# EAGLE schematic Main&MotorBoard (EAGLE 9.7.0)
Assembly variants: supply, A

## Sheet 1 of 7: Cover
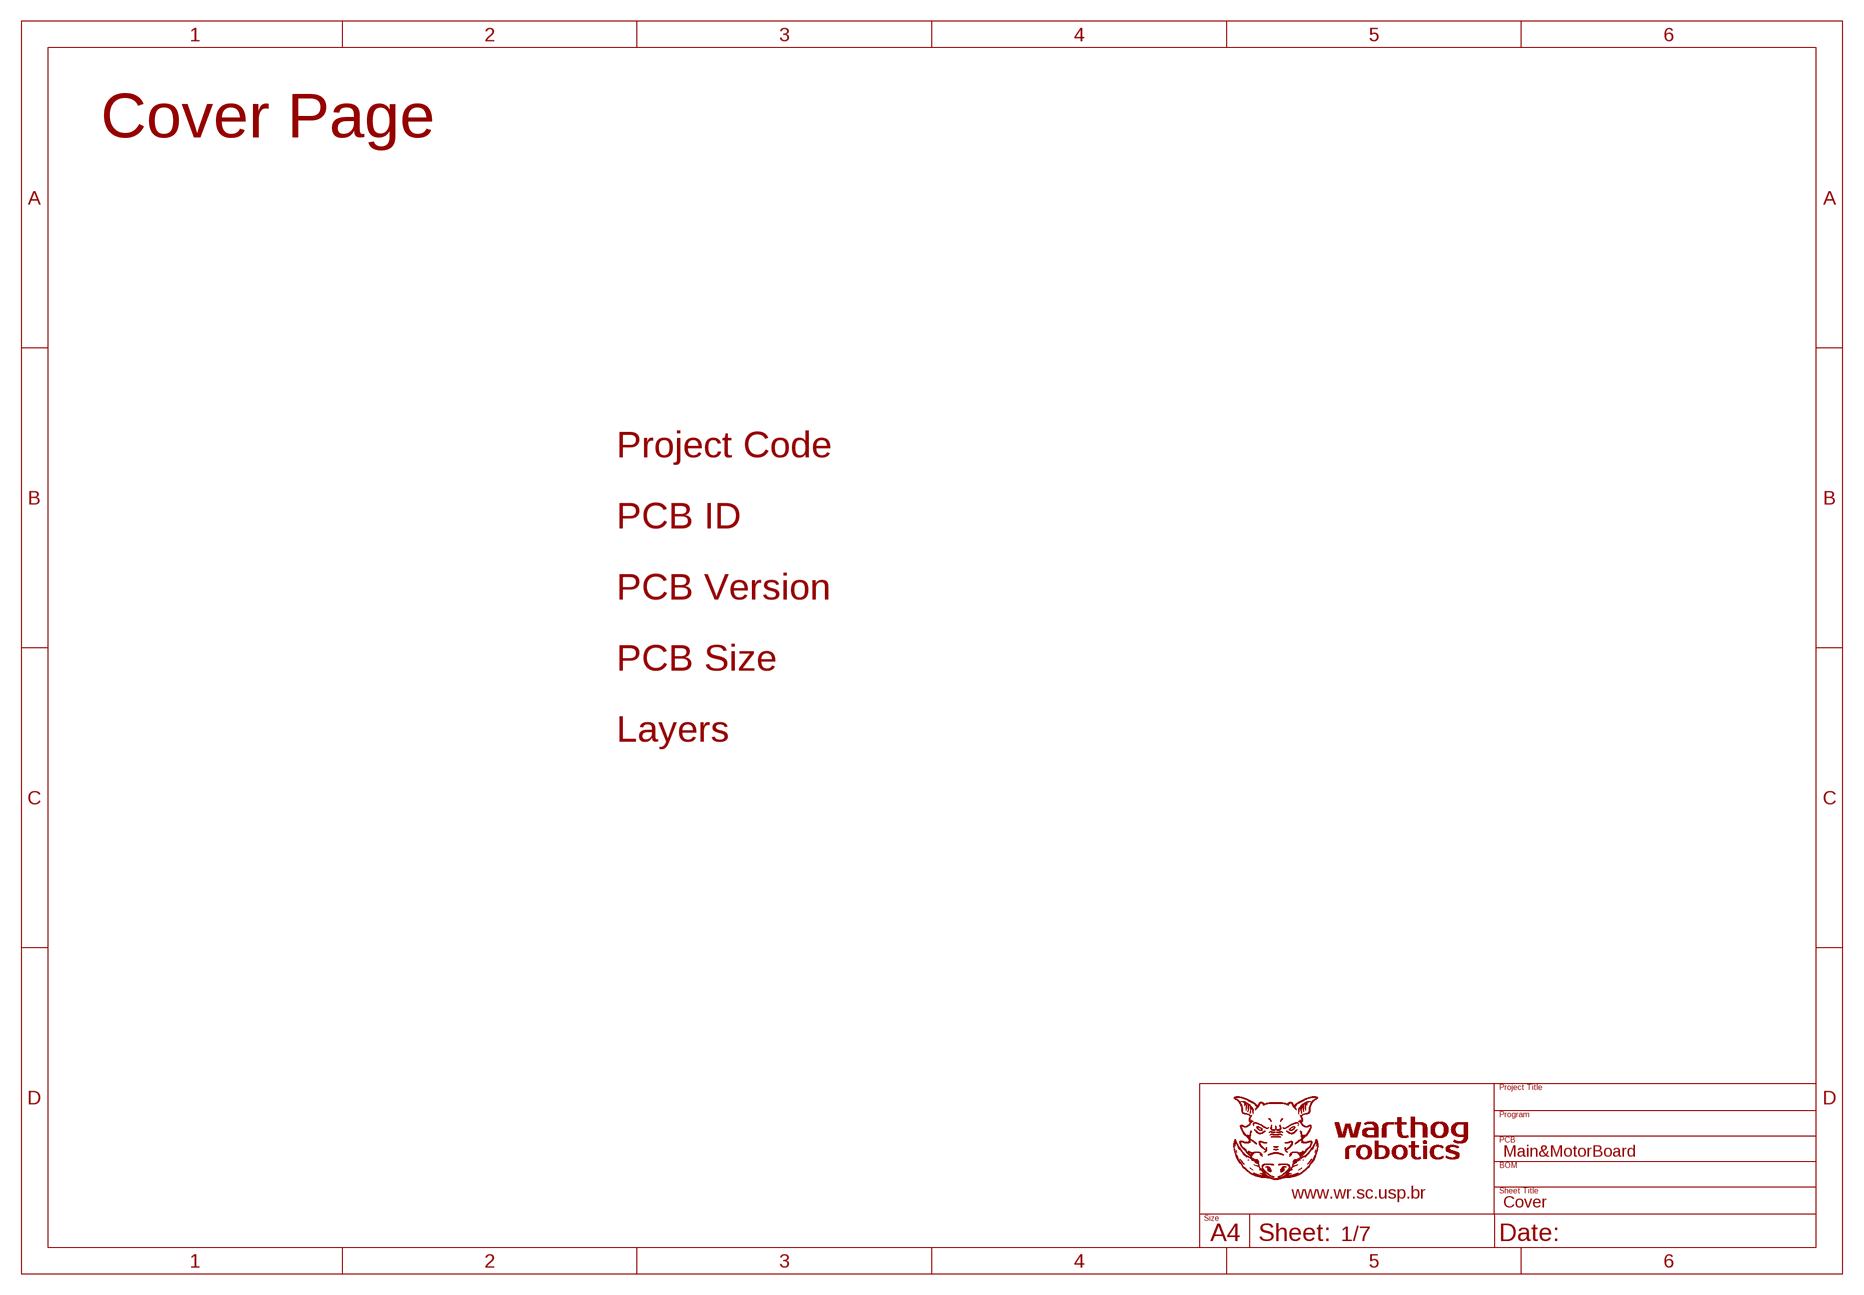
[diagram p0: schematic, sheet 1]

## Sheet 2 of 7: SUPPLY
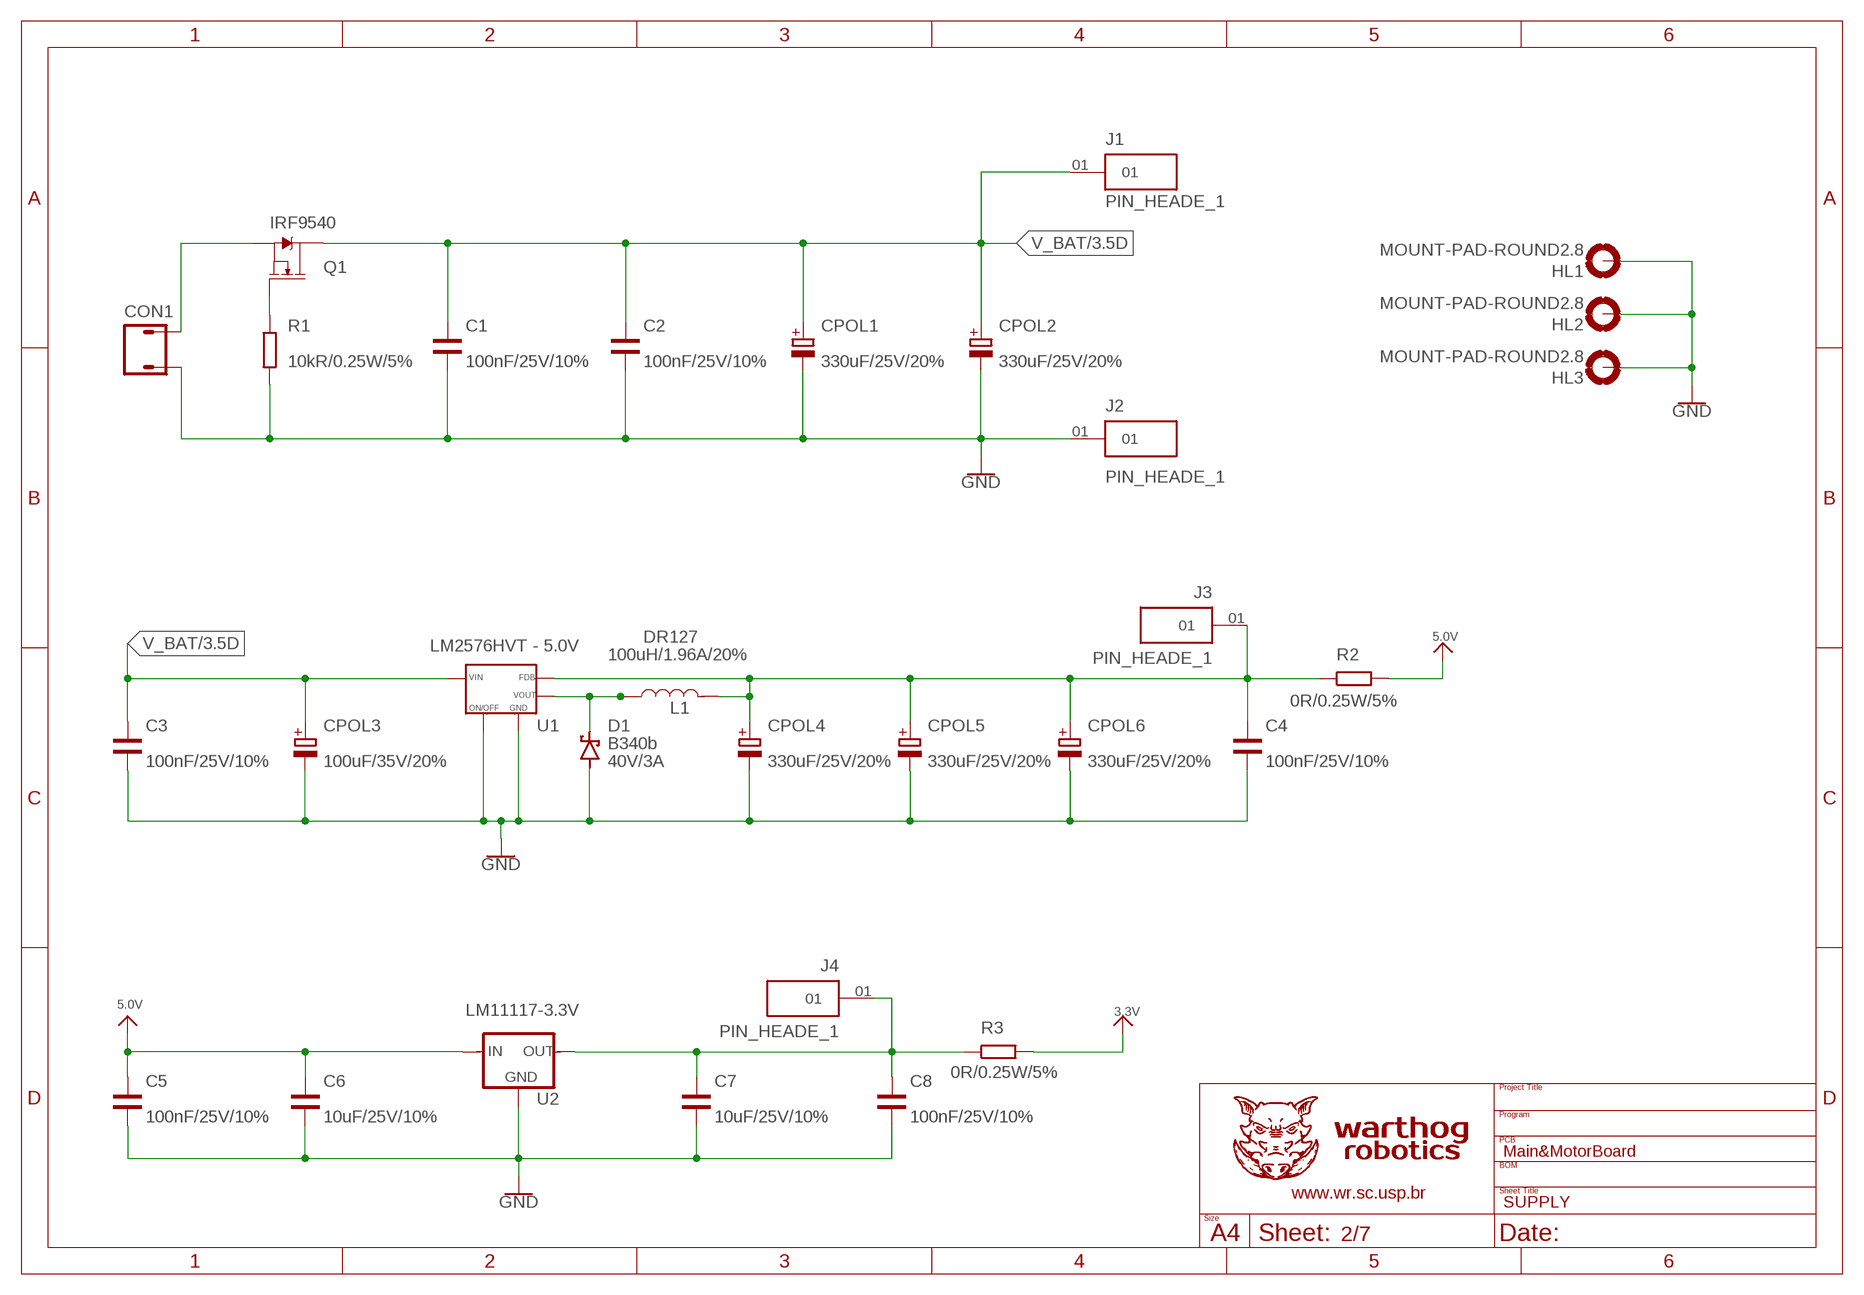
[diagram p1: schematic, sheet 2]

### Parts
C1  100nF/25V/10%  C0805(M)  [C0805(M)]
C2  100nF/25V/10%  C0805(M)  [C0805(M)]
C3  100nF/25V/10%  C0805(M)  [C0805(M)]
C4  100nF/25V/10%  C0805(M)  [C0805(M)]
C5  100nF/25V/10%  C0805(M)  [C0805(M)]
C6  10uF/25V/10%  C0805(M)  [C0805(M)]
C7  10uF/25V/10%  C0805(M)  [C0805(M)]
C8  100nF/25V/10%  C0805(M)  [C0805(M)]
CON1  MICROFIT_HEADER-2X01-90°-BACKUP  [2X01-3.00MM-90°]
CPOL1  330uF/25V/20%  CPOLE5-10.5  [E5-10,5]
CPOL2  330uF/25V/20%  CPOLE5-10.5  [E5-10,5]
CPOL3  100uF/35V/20%  CPOLE5-10.5  [E5-10,5]
CPOL4  330uF/25V/20%  CPOLE5-10.5  [E5-10,5]
CPOL5  330uF/25V/20%  CPOLE5-10.5  [E5-10,5]
CPOL6  330uF/25V/20%  CPOLE5-10.5  [E5-10,5]
D1  40V/3A  DIODE_SCHOTTIK  [SMC]
HL1  MOUNT-PAD-ROUND2.8  [2,8-PAD]
HL2  MOUNT-PAD-ROUND2.8  [2,8-PAD]
HL3  MOUNT-PAD-ROUND2.8  [2,8-PAD]
J1  PIN_HEADE_1  [SAMTEC_MTMM-101-X-X-S-X]
J2  PIN_HEADE_1  [SAMTEC_MTMM-101-X-X-S-X]
J3  PIN_HEADE_1  [SAMTEC_MTMM-101-X-X-S-X]
J4  PIN_HEADE_1  [SAMTEC_MTMM-101-X-X-S-X]
L1  100uH/1.96A/20%  INDUCTOR  [DR127]
Q1  IRF9540  [TO254P1052X465X1989-3]
R1  10kR/0.25W/5%  R0805(M)  [C0805(M)]  (not fitted in variant supply)
R2  0R/0.25W/5%  R0805(M)  [C0805(M)]
R3  0R/0.25W/5%  R0805(M)  [C0805(M)]
U1  LM2576HVT - 5.0V  LM2576  [TO263-5]
U2  LM11117-3.3V  REG1117  [SOT230P700X170-4]

### Nets
3.3V [Power]: R3.2 ; also sheet 4,5,6,7
5.0V [Power]: C5.1 C6.1 R2.2 U2.3(IN) ; also sheet 3,4
FDB: C4.1 CPOL4.+ CPOL5.+ CPOL6.+ J3.01 L1.1 R2.1 U1.FDB(FEEDBACK)
GND [Power]: C1.2 C2.2 C3.2 C4.2 C5.2 C6.2 C7.2 C8.2 CON1.2 CPOL1.- CPOL2.- CPOL3.- CPOL4.- CPOL5.- CPOL6.- D1.A HL1.B2,8(MOUNT) HL2.B2,8(MOUNT) HL3.B2,8(MOUNT) J2.01 R1.2 U1.GND U1.ON/OFF(ON\OFF) U1.TAB(GND) U2.1(GND) ; also sheet 3,4,5,6,7
N$5: CON1.1 Q1.S
N$7: Q1.G R1.1
N$11 [Power]: D1.C L1.2 U1.OUT
OUT_3.3: C7.1 C8.1 J4.01 R3.1 U2.2(OUT) U2.4(OUT)
V_BAT: C1.1 C2.1 C3.1 CPOL1.+ CPOL2.+ CPOL3.+ J1.01 Q1.D U1.VIN ; also sheet 3,4

### Notes on the sheet
- DR127
- B340b

## Sheet 3 of 7: MOTOR DRIVE
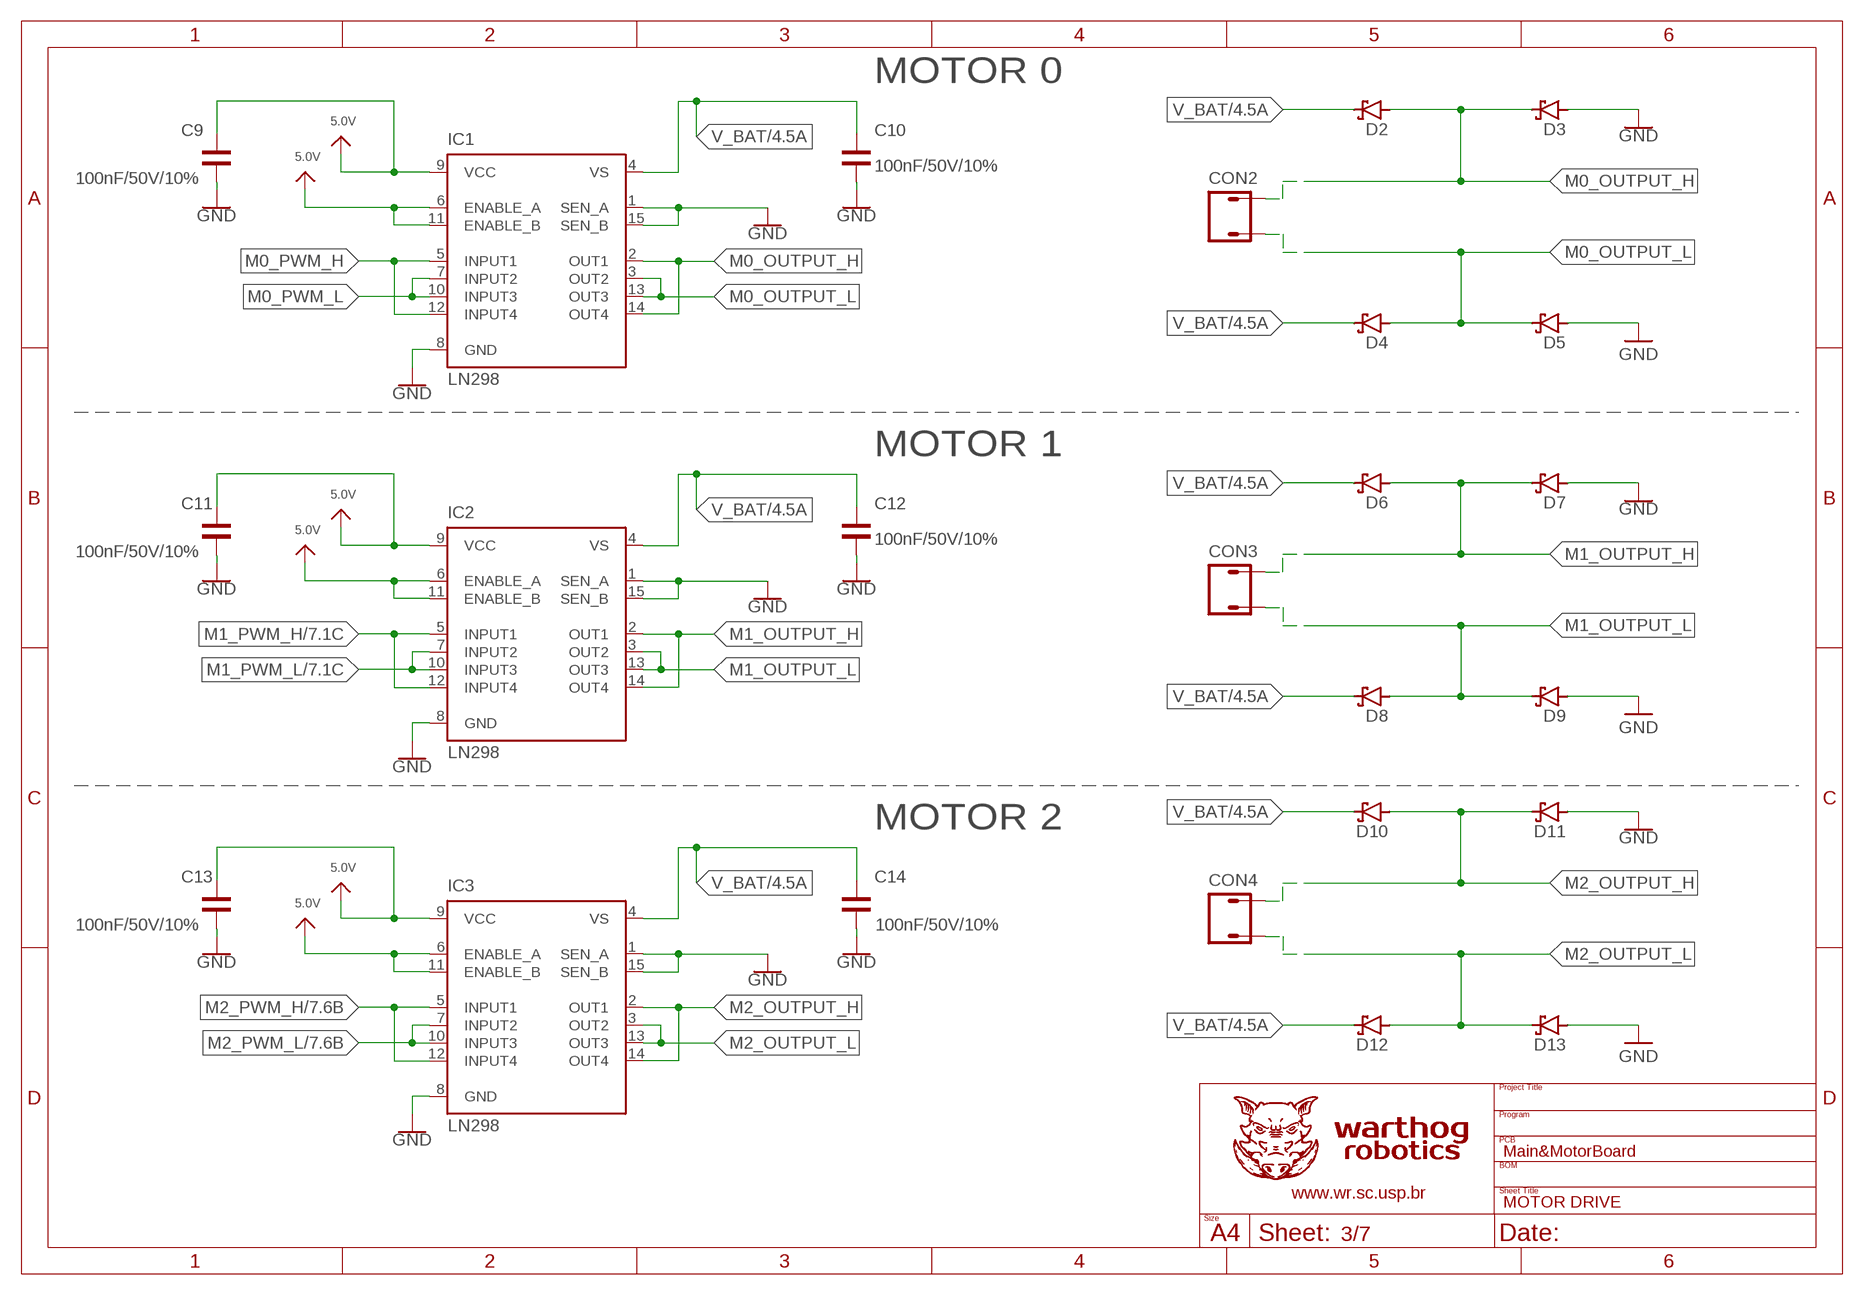
[diagram p2: schematic, sheet 3]

### Parts
C9  100nF/50V/10%  C0805(N)  [C0805(N)]
C10  100nF/50V/10%  C0805(N)  [C0805(N)]
C11  100nF/50V/10%  C0805(N)  [C0805(N)]
C12  100nF/50V/10%  C0805(N)  [C0805(N)]
C13  100nF/50V/10%  C0805(N)  [C0805(N)]
C14  100nF/50V/10%  C0805(N)  [C0805(N)]
CON2  MICROFIT_HEADER-2X01-90°-BACKUP  [2X01-3.00MM-90°]
CON3  MICROFIT_HEADER-2X01-90°-BACKUP  [2X01-3.00MM-90°]
CON4  MICROFIT_HEADER-2X01-90°-BACKUP  [2X01-3.00MM-90°]
D2  1N5406  [DO201-15(N)]
D3  1N5406  [DO201-15(N)]
D4  1N5406  [DO201-15(N)]
D5  1N5406  [DO201-15(N)]
D6  1N5406  [DO201-15(N)]
D7  1N5406  [DO201-15(N)]
D8  1N5406  [DO201-15(N)]
D9  1N5406  [DO201-15(N)]
D10  1N5406  [DO201-15(N)]
D11  1N5406  [DO201-15(N)]
D12  1N5406  [DO201-15(N)]
D13  1N5406  [DO201-15(N)]
IC1  LN298  L298  [MULTIWATT-15]  (not fitted in variant supply)
IC2  LN298  L298  [MULTIWATT-15]  (not fitted in variant supply)
IC3  LN298  L298  [MULTIWATT-15]  (not fitted in variant supply)

### Nets
5.0V [Power]: C9.1 C11.1 C13.1 IC1.6(ENABLE_A) IC1.9(VCC) IC1.11(ENABLE_B) IC2.6(ENABLE_A) IC2.9(VCC) IC2.11(ENABLE_B) IC3.6(ENABLE_A) IC3.9(VCC) IC3.11(ENABLE_B) ; also sheet 2,4
GND [Power]: C9.2 C10.2 C11.2 C12.2 C13.2 C14.2 D3.A D5.A D7.A D9.A D11.A D13.A IC1.1(SEN_A) IC1.8(GND) IC1.15(SEN_B) IC2.1(SEN_A) IC2.8(GND) IC2.15(SEN_B) IC3.1(SEN_A) IC3.8(GND) IC3.15(SEN_B) ; also sheet 2,4,5,6,7
M0_OUTPUT_H: CON2.1 D2.A D3.C IC1.2(OUT1) IC1.14(OUT4)
M0_OUTPUT_L: CON2.2 D4.A D5.C IC1.3(OUT2) IC1.13(OUT3)
M0_PWM_H: IC1.5(INPUT1) IC1.12(INPUT4)
M0_PWM_L: IC1.7(INPUT2) IC1.10(INPUT3)
M1_OUTPUT_H: CON3.1 D6.A D7.C IC2.2(OUT1) IC2.14(OUT4)
M1_OUTPUT_L: CON3.2 D8.A D9.C IC2.3(OUT2) IC2.13(OUT3)
M1_PWM_H: IC2.5(INPUT1) IC2.12(INPUT4) ; also sheet 7
M1_PWM_L: IC2.7(INPUT2) IC2.10(INPUT3) ; also sheet 7
M2_OUTPUT_H: CON4.1 D10.A D11.C IC3.2(OUT1) IC3.14(OUT4)
M2_OUTPUT_L: CON4.2 D12.A D13.C IC3.3(OUT2) IC3.13(OUT3)
M2_PWM_H: IC3.5(INPUT1) IC3.12(INPUT4) ; also sheet 7
M2_PWM_L: IC3.7(INPUT2) IC3.10(INPUT3) ; also sheet 7
V_BAT: C10.1 C12.1 C14.1 D2.C D4.C D6.C D8.C D10.C D12.C IC1.4(VS) IC2.4(VS) IC3.4(VS) ; also sheet 2,4

### Notes on the sheet
- MOTOR 0
- MOTOR 1
- MOTOR 2

## Sheet 4 of 7: COMMUNICATION
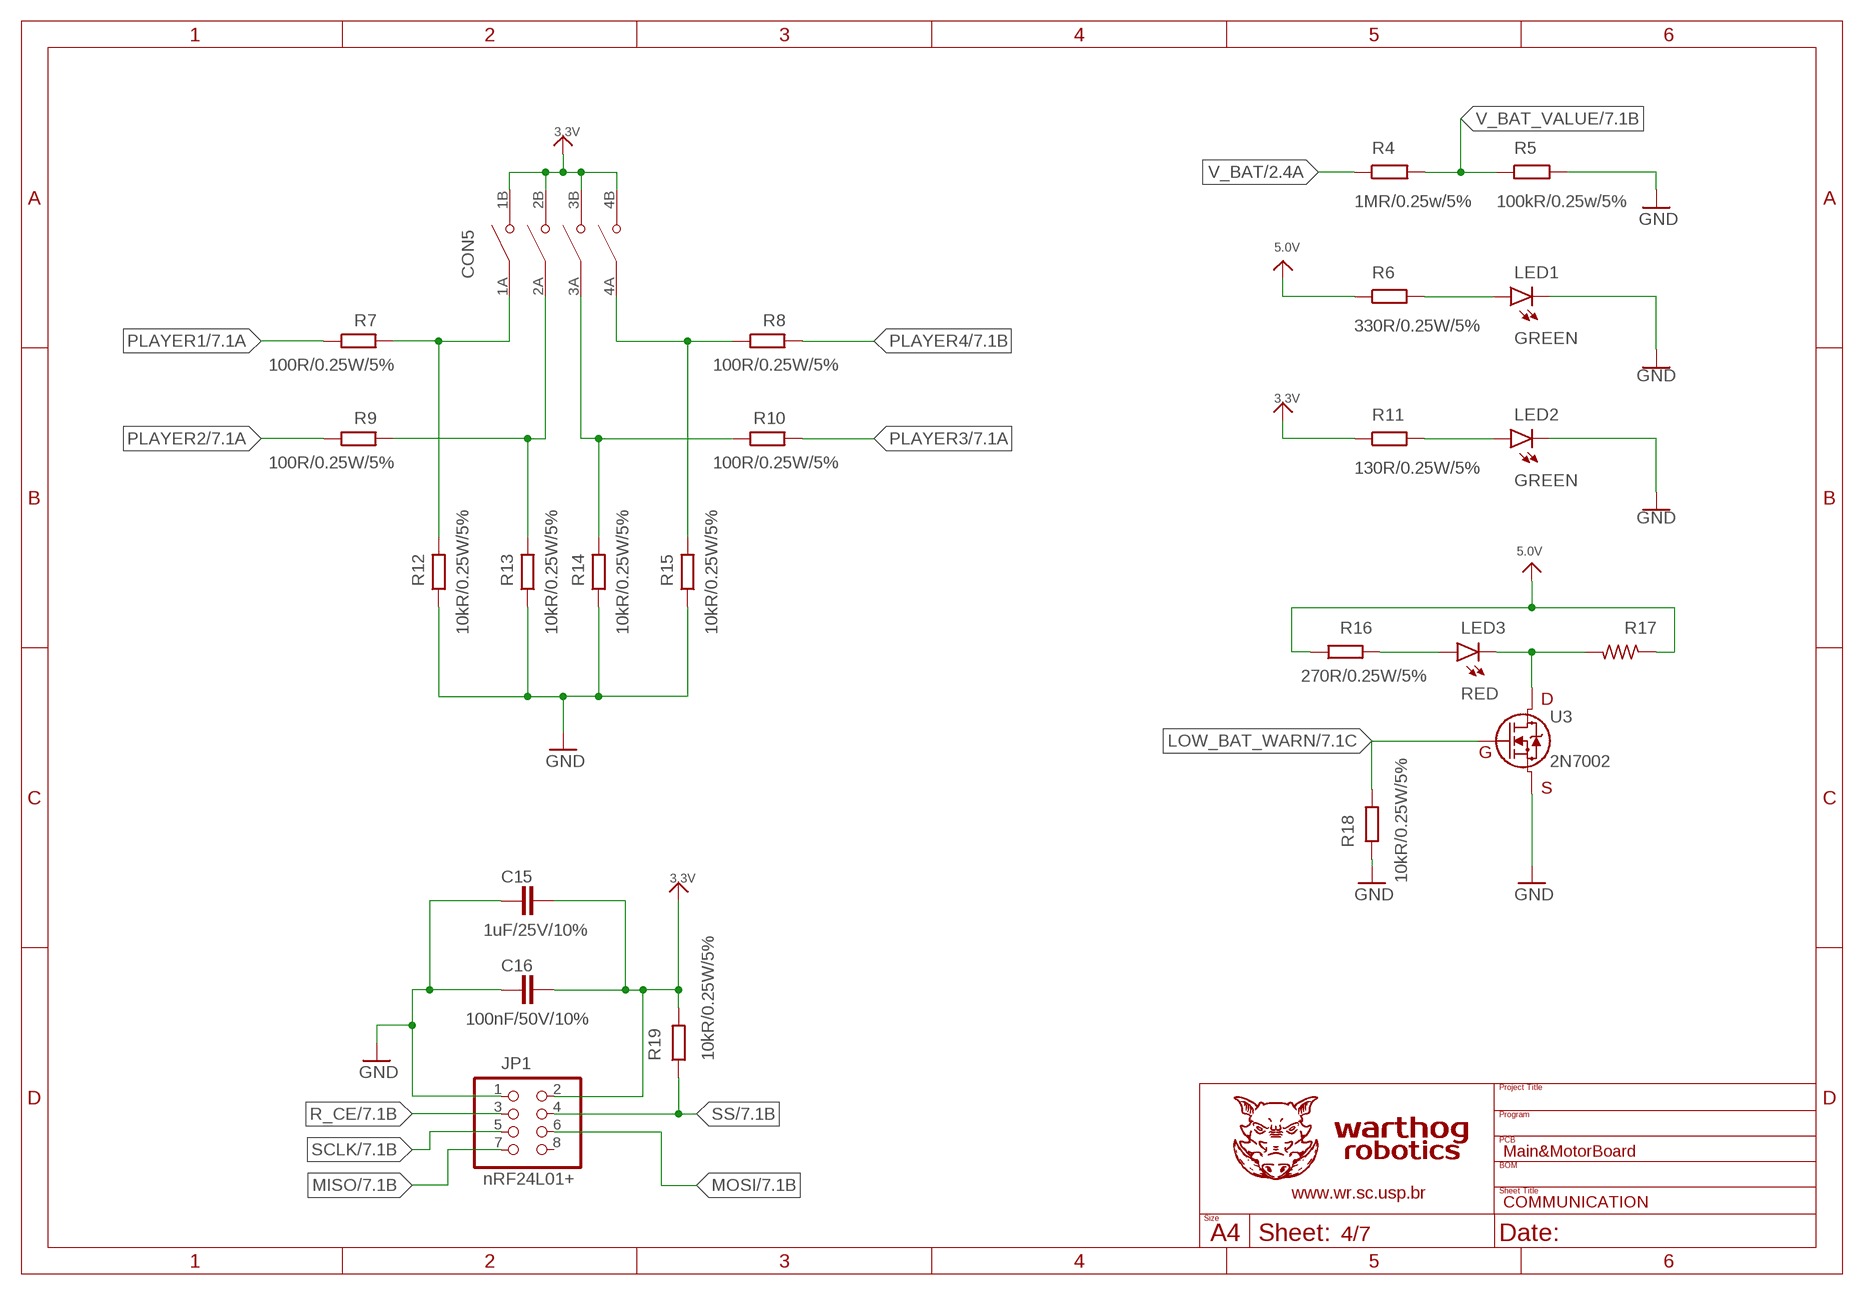
[diagram p3: schematic, sheet 4]

### Parts
C15  1uF/25V/10%  C-EUC0805  [C0805]
C16  100nF/50V/10%  C-EUC0805  [C0805]
CON5  DS01C-254-L-04BE  [SW_DS01C-254-L-04BE]
JP1  nRF24L01+  PINHD-2X4  [2X04]
LED1  GREEN  LEDSML0402  [SML0402]
LED2  GREEN  LEDSML0402  [SML0402]
LED3  RED  LEDSML0402  [SML0402]
R4  1MR/0.25w/5%  R-EU_R0805  [R0805]
R5  100kR/0.25w/5%  R-EU_R0805  [R0805]
R6  330R/0.25W/5%  RC0603(M)  [C0603(M)]
R7  100R/0.25W/5%  R0805(M)  [C0805(M)]
R8  100R/0.25W/5%  R0805(M)  [C0805(M)]
R9  100R/0.25W/5%  R0805(M)  [C0805(M)]
R10  100R/0.25W/5%  R0805(M)  [C0805(M)]
R11  130R/0.25W/5%  RC0603(M)  [C0603(M)]
R12  10kR/0.25W/5%  R0805(M)  [C0805(M)]
R13  10kR/0.25W/5%  R0805(M)  [C0805(M)]
R14  10kR/0.25W/5%  R0805(M)  [C0805(M)]
R15  10kR/0.25W/5%  R0805(M)  [C0805(M)]
R16  270R/0.25W/5%  R0805(M)  [C0805(M)]
R17  R-US_0204/7  [0204/7]
R18  10kR/0.25W/5%  R0805(M)  [C0805(M)]
R19  10kR/0.25W/5%  R0805(M)  [C0805(M)]
U3  2N7002  2N7002,215TO-236AB_NEX-M  [TO-236AB_NEX-M]

### Nets
3.3V [Power]: C15.2 C16.2 CON5.1B(NO1) CON5.2B(NO2) CON5.3B(NO3) CON5.4B(NO4) JP1.2 R11.1 R19.2 ; also sheet 2,5,6,7
5.0V [Power]: R6.1 R16.1 R17.1 ; also sheet 2,3
GND [Power]: C15.1 C16.1 JP1.1 LED1.1(C) LED2.1(C) R5.2 R12.1 R13.1 R14.1 R15.1 R18.1 U3.2 ; also sheet 2,3,5,6,7
LOW_BAT_WARN: R18.2 U3.1 ; also sheet 7
MISO: JP1.7 ; also sheet 7
MOSI: JP1.6 ; also sheet 7
N$2: LED1.2(A) R6.2
N$3: LED2.2(A) R11.2
N$8 [Power]: LED3.1(C) R17.2 U3.3
N$9: LED3.2(A) R16.2
N$31 [Power]: CON5.1A(COM1) R7.2 R12.2
N$35 [Power]: CON5.2A(COM2) R9.2 R13.2
N$37 [Power]: CON5.3A(COM3) R10.1 R14.2
N$58 [Power]: CON5.4A(COM4) R8.1 R15.2
PLAYER1: R7.1 ; also sheet 7
PLAYER2: R9.1 ; also sheet 7
PLAYER3: R10.2 ; also sheet 7
PLAYER4: R8.2 ; also sheet 7
R_CE: JP1.3 ; also sheet 7
SCLK: JP1.5 ; also sheet 7
SS: JP1.4 R19.1 ; also sheet 7
V_BAT: R4.1 ; also sheet 2,3
V_BAT_VALUE: R4.2 R5.1 ; also sheet 7
Unconnected: JP1.8

## Sheet 5 of 7: SENSORS_AND_BUTTOMS
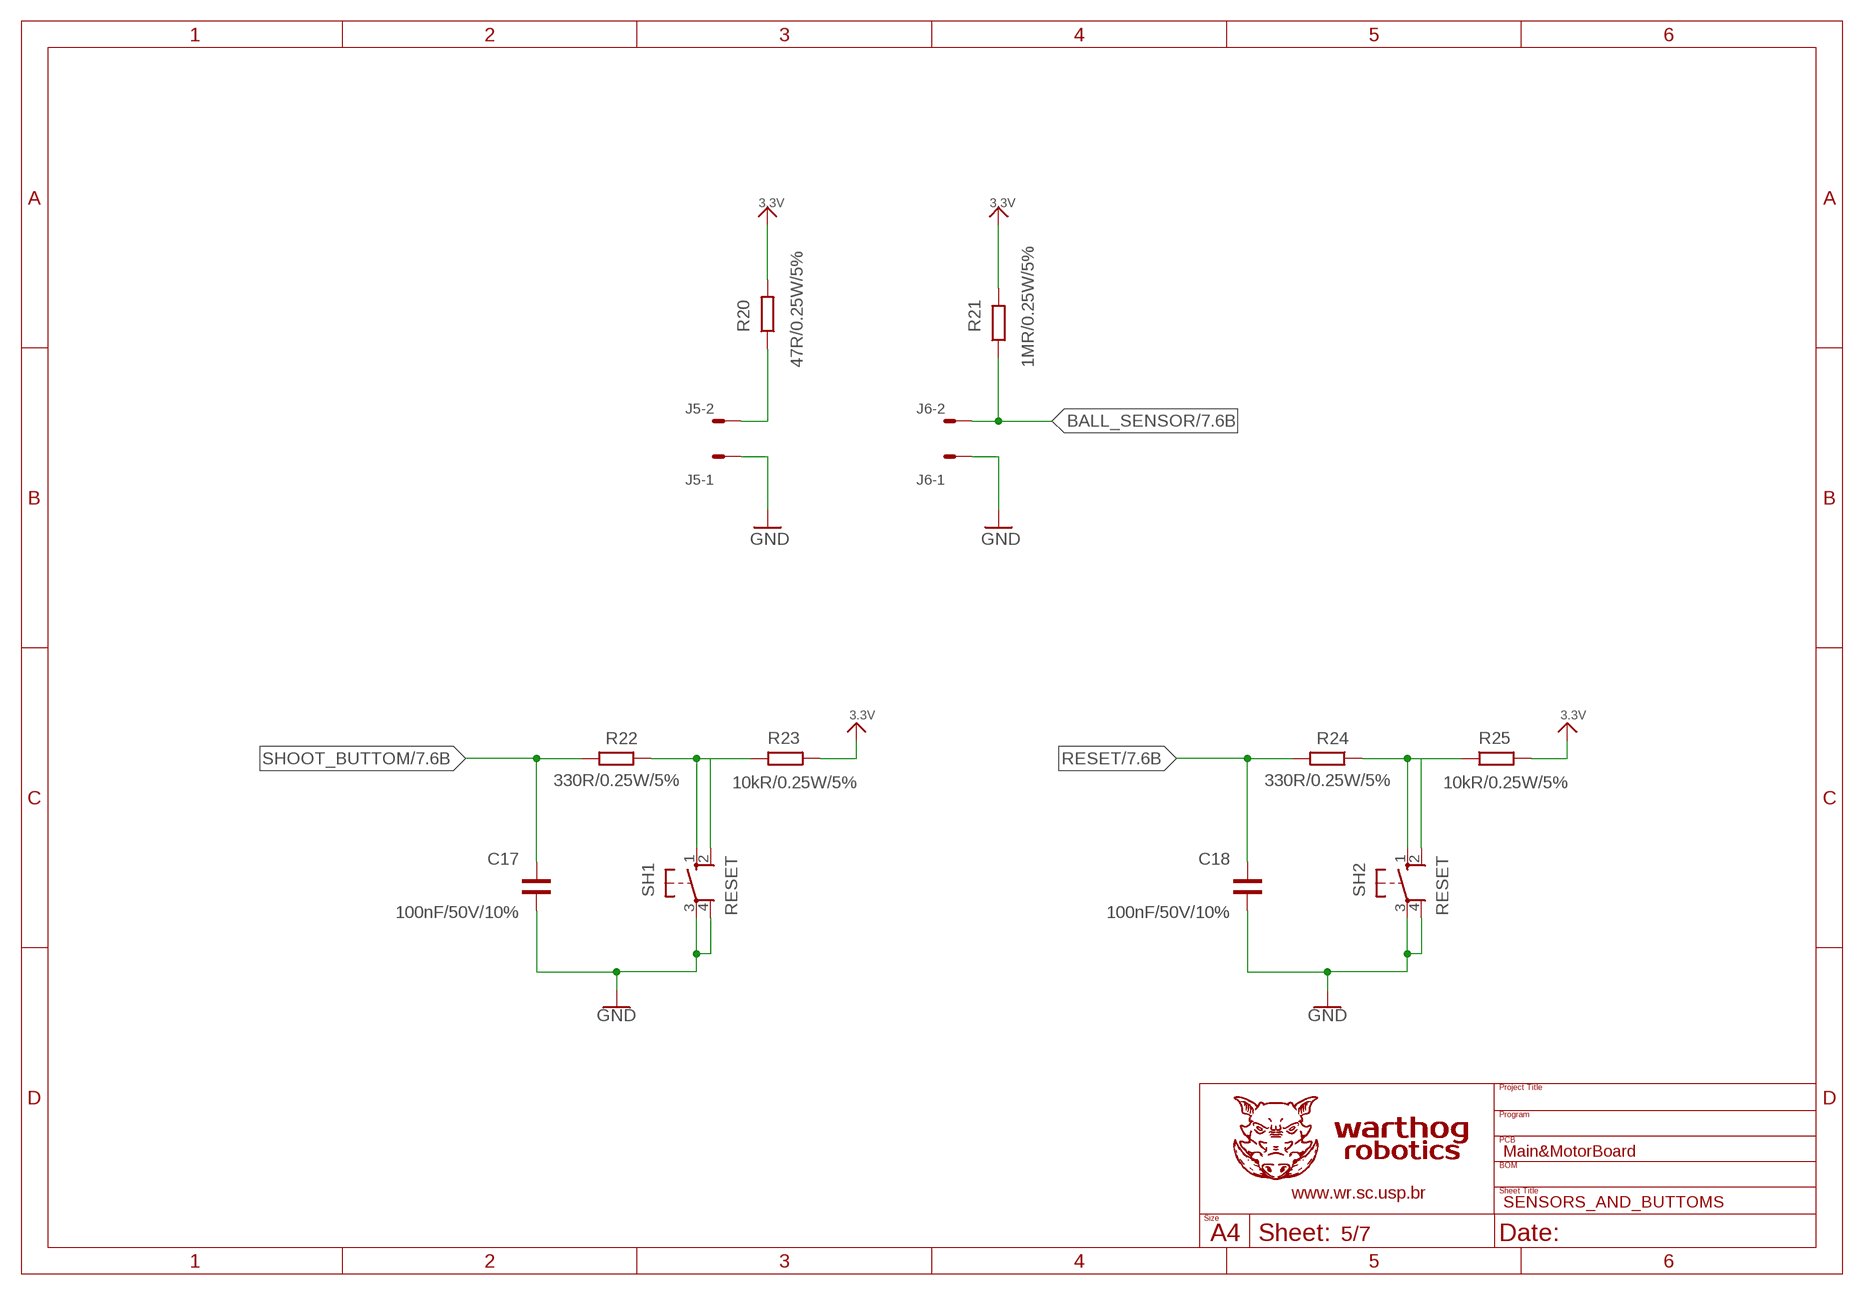
[diagram p4: schematic, sheet 5]

### Parts
C17  100nF/50V/10%  C0805(M)  [C0805(M)]
C18  100nF/50V/10%  C0805(M)  [C0805(M)]
J5  22-05-7028-02  [7395-02]
J6  22-05-7028-02  [7395-02]
R20  47R/0.25W/5%  R0805(M)  [C0805(M)]
R21  1MR/0.25W/5%  R0805(M)  [C0805(M)]
R22  330R/0.25W/5%  RC1206(N)  [C1206(N)]
R23  10kR/0.25W/5%  RC1206(N)  [C1206(N)]
R24  330R/0.25W/5%  RC1206(N)  [C1206(N)]
R25  10kR/0.25W/5%  RC1206(N)  [C1206(N)]
SH1  RESET  PUSH_BUTTOM  [B3F-10XX]
SH2  RESET  PUSH_BUTTOM  [B3F-10XX]

### Nets
3.3V [Power]: R20.2 R21.2 R23.2 R25.2 ; also sheet 2,4,6,7
BALL_SENSOR: J6.2 R21.1 ; also sheet 7
GND [Power]: C17.2 C18.2 J5.1 J6.1 SH1.3(P) SH1.4(P1) SH2.3(P) SH2.4(P1) ; also sheet 2,3,4,6,7
N$1: SH2.2(S1)
N$6 [Power]: J5.2 R20.1
N$16: R24.1 R25.1 SH2.1(S)
N$21: R22.1 R23.1 SH1.1(S)
N$22: SH1.2(S1)
RESET: C18.1 R24.2 ; also sheet 7
SHOOT_BUTTOM: C17.1 R22.2 ; also sheet 7

## Sheet 6 of 7: KICK'S_CONNECTION
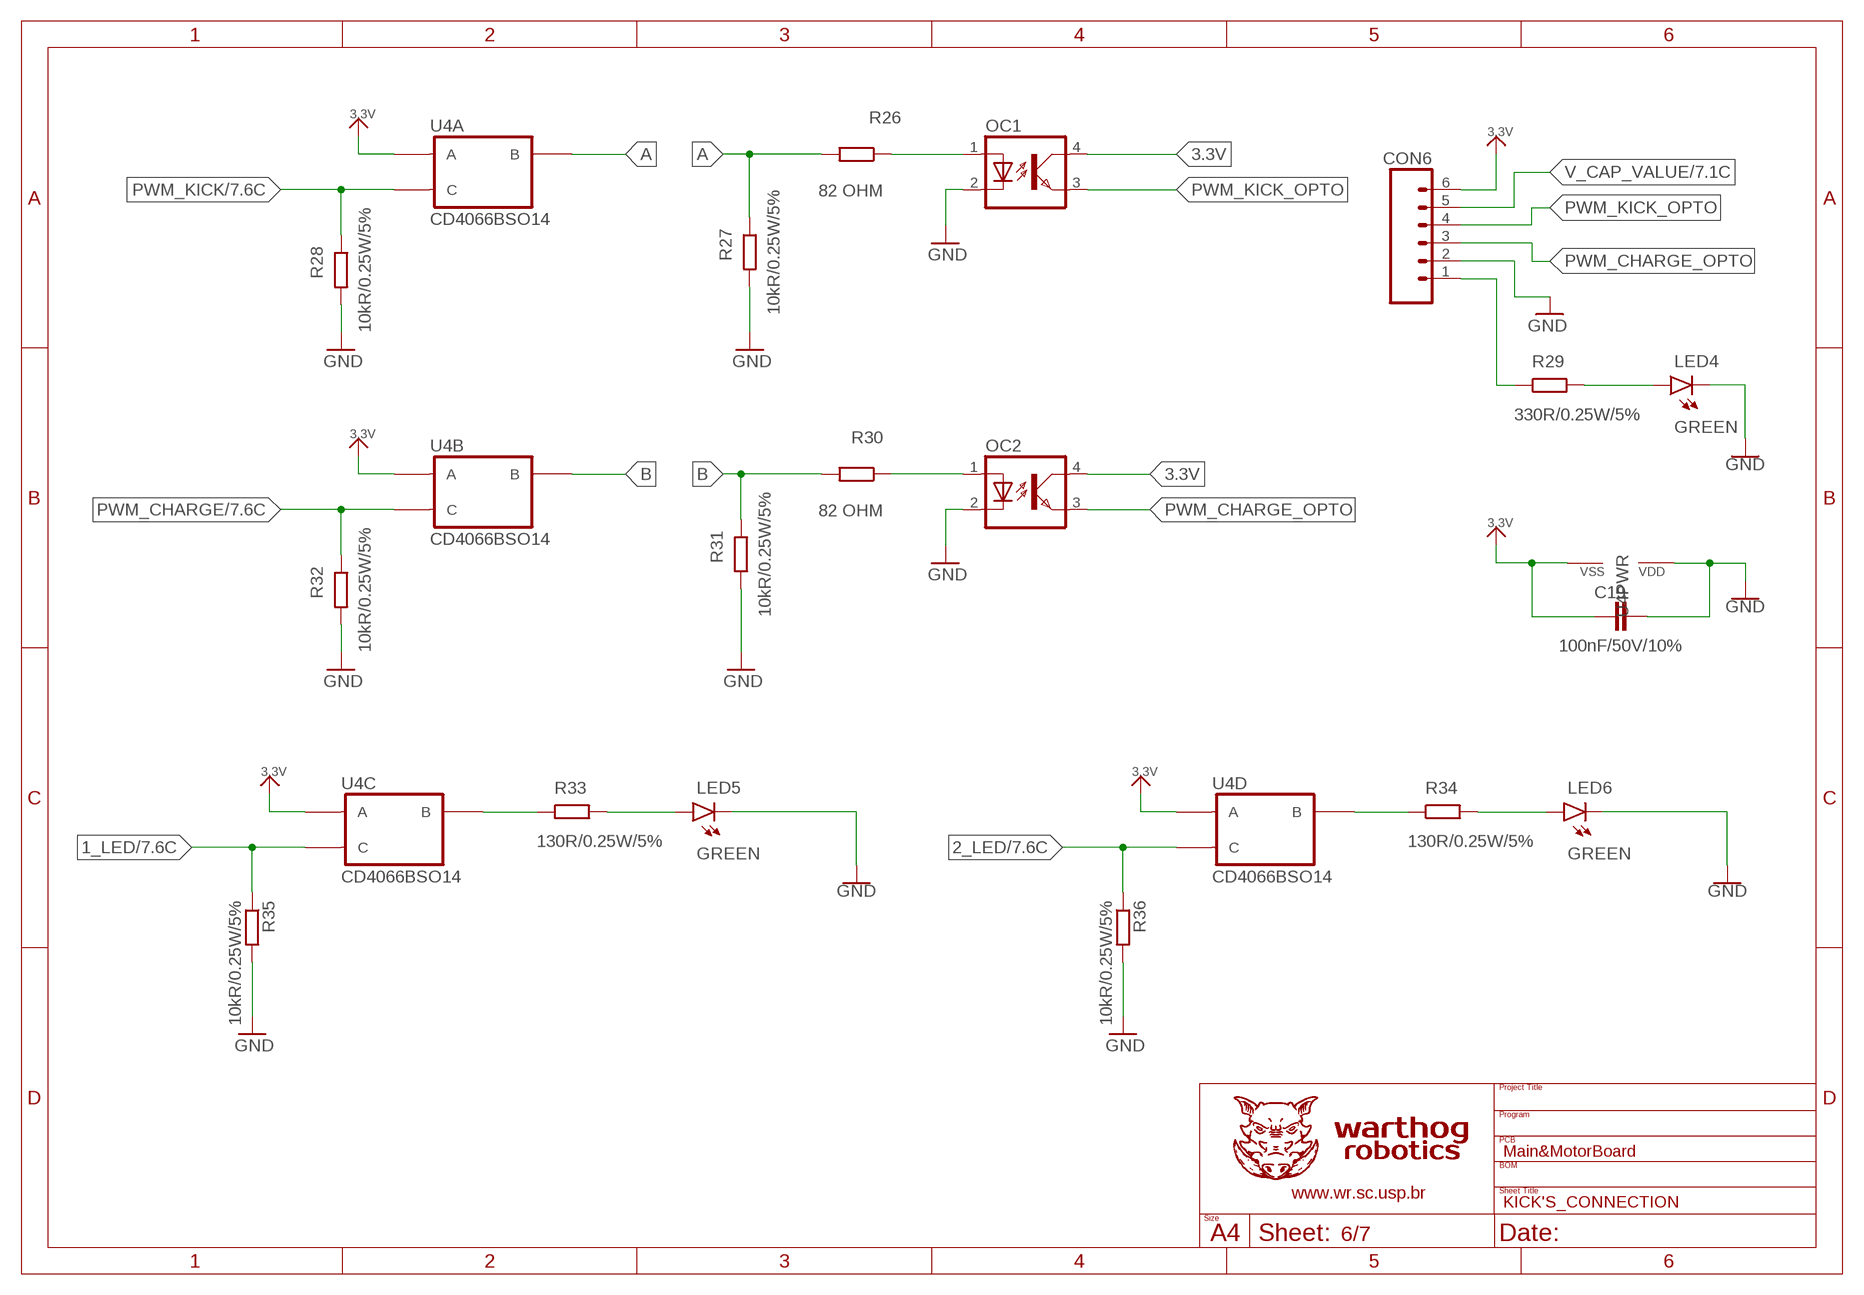
[diagram p5: schematic, sheet 6]

### Parts
C19  100nF/50V/10%  C-EUC0805  [C0805]
CON6  PIN_HEADER_MALE-1X06  [1X06-2.54MM]
LED4  GREEN  LEDSML0402  [SML0402]
LED5  GREEN  LEDSML0402  [SML0402]
LED6  GREEN  LEDSML0402  [SML0402]
OC1  PC817  [DIL04]
OC2  PC817  [DIL04]
R26  82 OHM  R0805(M)  [C0805(M)]
R27  10kR/0.25W/5%  R0805(M)  [C0805(M)]
R28  10kR/0.25W/5%  R0805(M)  [C0805(M)]
R29  330R/0.25W/5%  R0805(M)  [C0805(M)]
R30  82 OHM  R0805(M)  [C0805(M)]
R31  10kR/0.25W/5%  R0805(M)  [C0805(M)]
R32  10kR/0.25W/5%  R0805(M)  [C0805(M)]
R33  130R/0.25W/5%  RC0603(M)  [C0603(M)]
R34  130R/0.25W/5%  RC0603(M)  [C0603(M)]
R35  10kR/0.25W/5%  R0805(M)  [C0805(M)]
R36  10kR/0.25W/5%  R0805(M)  [C0805(M)]
U4  CD4066BSO14  [SO14(M)]

### Nets
1_LED: R35.1 U4.6(C:C) ; also sheet 7
2_LED: R36.1 U4.12(D:C) ; also sheet 7
3.3V [Power]: C19.1 CON6.6 OC1.4(COL) OC2.4(COL) U4.1(A:A) U4.4(B:A) U4.7(PWR:VSS) U4.8(C:A) U4.11(D:A) ; also sheet 2,4,5,7
3.3V_LED: CON6.1 R29.1
A: R26.2 R27.1 U4.2(A:B)
B: R30.2 R31.1 U4.3(B:B)
GND [Power]: C19.2 CON6.2 LED4.1(C) LED5.1(C) LED6.1(C) OC1.2(C) OC2.2(C) R27.2 R28.2 R31.2 R32.2 R35.2 R36.2 U4.14(PWR:VDD) ; also sheet 2,3,4,5,7
N$4: LED4.2(A) R29.2
N$10: OC1.1(A) R26.1
N$12: LED6.2(A) R34.2
N$13: LED5.2(A) R33.2
N$14: R34.1 U4.10(D:B)
N$15: R33.1 U4.9(C:B)
N$23: OC2.1(A) R30.1
PWM_CHARGE: R32.1 U4.5(B:C) ; also sheet 7
PWM_CHARGE_OPTO: CON6.3 OC2.3(EMIT)
PWM_KICK: R28.1 U4.13(A:C) ; also sheet 7
PWM_KICK_OPTO: CON6.4 OC1.3(EMIT)
V_CAP_VALUE: CON6.5 ; also sheet 7

## Sheet 7 of 7: MICROCONTROLLER
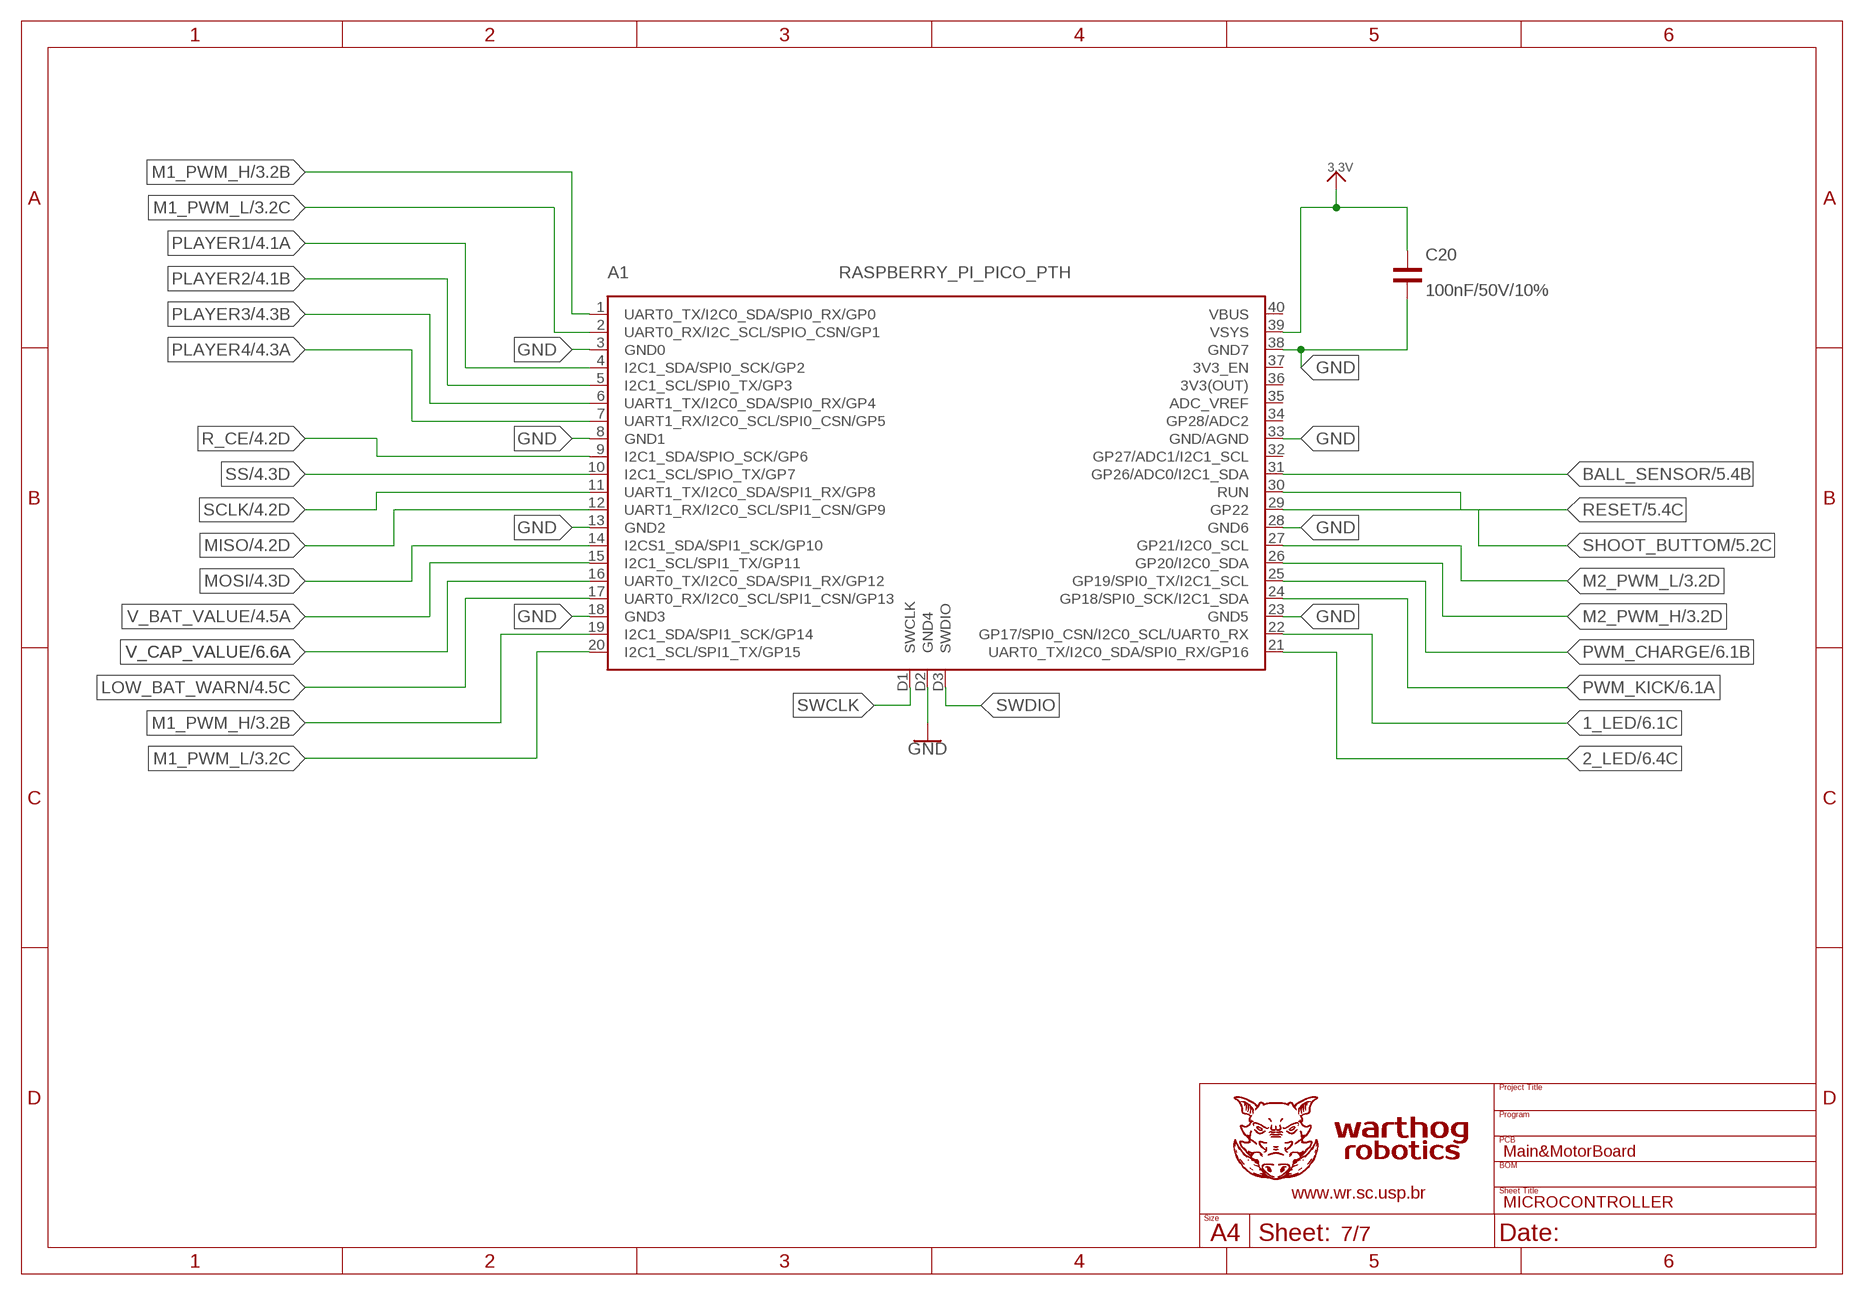
[diagram p6: schematic, sheet 7]

### Parts
A1  RASPBERRY_PI_PICO_PTH  [RASPBERRY_PI_PICO_PTH]
C20  100nF/50V/10%  C0805(M)  [C0805(M)]

### Nets
1_LED: A1.22(GP17/SPI0_CSN/I2C0_SCL/UART0_RX) ; also sheet 6
2_LED: A1.21(UART0_TX/I2C0_SDA/SPI0_RX/GP16) ; also sheet 6
3.3V [Power]: A1.39(VSYS) C20.1 ; also sheet 2,4,5,6
BALL_SENSOR: A1.31(GP26/ADC0/I2C1_SDA) ; also sheet 5
GND [Power]: A1.3(GND0) A1.8(GND1) A1.13(GND2) A1.18(GND3) A1.23(GND5) A1.28(GND6) A1.33(GND/AGND) A1.38(GND7) A1.D2(GND4) C20.2 ; also sheet 2,3,4,5,6
LOW_BAT_WARN: A1.17(UART0_RX/I2C0_SCL/SPI1_CSN/GP13) ; also sheet 4
M1_PWM_H: A1.1(UART0_TX/I2C0_SDA/SPI0_RX/GP0) A1.19(I2C1_SDA/SPI1_SCK/GP14) ; also sheet 3
M1_PWM_L: A1.2(UART0_RX/I2C_SCL/SPIO_CSN/GP1) A1.20(I2C1_SCL/SPI1_TX/GP15) ; also sheet 3
M2_PWM_H: A1.26(GP20/I2C0_SDA) ; also sheet 3
M2_PWM_L: A1.27(GP21/I2C0_SCL) ; also sheet 3
MISO: A1.12(UART1_RX/I2C0_SCL/SPI1_CSN/GP9) ; also sheet 4
MOSI: A1.14(I2CS1_SDA/SPI1_SCK/GP10) ; also sheet 4
PLAYER1: A1.4(I2C1_SDA/SPI0_SCK/GP2) ; also sheet 4
PLAYER2: A1.5(I2C1_SCL/SPI0_TX/GP3) ; also sheet 4
PLAYER3: A1.6(UART1_TX/I2C0_SDA/SPI0_RX/GP4) ; also sheet 4
PLAYER4: A1.7(UART1_RX/I2C0_SCL/SPI0_CSN/GP5) ; also sheet 4
PWM_CHARGE: A1.25(GP19/SPI0_TX/I2C1_SCL) ; also sheet 6
PWM_KICK: A1.24(GP18/SPI0_SCK/I2C1_SDA) ; also sheet 6
R_CE: A1.9(I2C1_SDA/SPIO_SCK/GP6) ; also sheet 4
RESET: A1.30(RUN) ; also sheet 5
SCLK: A1.11(UART1_TX/I2C0_SDA/SPI1_RX/GP8) ; also sheet 4
SHOOT_BUTTOM: A1.29(GP22) ; also sheet 5
SS: A1.10(I2C1_SCL/SPIO_TX/GP7) ; also sheet 4
SWCLK: A1.D1(SWCLK)
SWDIO: A1.D3(SWDIO)
V_BAT_VALUE: A1.15(I2C1_SCL/SPI1_TX/GP11) ; also sheet 4
V_CAP_VALUE: A1.16(UART0_TX/I2C0_SDA/SPI1_RX/GP12) ; also sheet 6
Unconnected: A1.32(GP27/ADC1/I2C1_SCL) A1.34(GP28/ADC2) A1.35(ADC_VREF) A1.36(3V3(OUT)) A1.37(3V3_EN) A1.40(VBUS)

## Library data of the parts
A1 = WarthogRobotics-Modules:RASPBERRY_PI_PICO_PTH
C1-C14 C17 C18 C20 = WarthogRobotics-RLC:C
C15 C16 C19 = rcl:C-EU: CAPACITOR, European symbol
CON1-CON4 = WarthogRobotics-Connectors:MICROFIT_HEADER-2X01-90°-BACKUP: Molex Micro-Fit 3.0 - Header Shrouded, Thru hole, Right Angle; P/N: SD-43045-0200, SD-43045-0201, SD-43045-0202 http://www.molex.com/pdm_docs/sd/430450200_sd.pdf
CON5 = WarthogRobotics-Connectors:DS01C-254-L-04BE: Check availability <https://pricing.snapeda.com/parts/DS01C-254-L-04BE/CUI%20Devices/view-part?ref=eda>; AVAILABILITY: In Stock; CHECK_PRICES: https://www.snapeda.com/parts/DS01C-254-L-04BE/CUI+Devices/view-part/?ref=eda; CUI_PURCHASE_URL: https://www.cuidevices.com/product/switches/dip-switches/ds01c-254-l-04be?utm_source=snapeda.com&utm_medium=referral&utm_campaign=snapedaBOM; DESCRIPTION: 4 Position, Through Hole, 2.54 mm Pitch, Raised Slide Actuator, Convex Bottom, Long Pin, DIP Switch; MF: CUI Devices; MP: DS01C-254-L-04BE; PACKAGE: None; PRICE: None; SNAPEDA_LINK: https://www.snapeda.com/parts/DS01C-254-L-04BE/CUI+Devices/view-part/?ref=snap
CON6 = WarthogRobotics-Connectors:PIN_HEADER_MALE-1X06
CPOL1-CPOL6 = WarthogRobotics-RLC:CPOL
D1 = Auriga_lib:DIODE_SCHOTTIK
D2-D13 = WarthogRobotics-Diodes:1N5406: SCHOTTKY DIODE
HL1-HL3 = WarthogRobotics-Holes:MOUNT-PAD-ROUND: MOUNTING PAD, round
IC1-IC3 = st-microelectronics:L298: DUAL FULL-BRIDGE DRIVER; MPN: L298N; OC_FARNELL: 1589425; OC_NEWARK: 32M1527
J1-J4 = Library:PIN_HEADE_1: Check availability <https://pricing.snapeda.com/parts/MTMM-101-04-L-S-160/Samtec/view-part?ref=eda>
J5 J6 = EP_molex_6410_7395 (1):22-?-02: CONNECTOR wire to board 2.54 mm (.1 inch) pitch header
JP1 = pinhead:PINHD-2X4: PIN HEADER
L1 = Auriga_lib:INDUCTOR
LED1-LED6 = WarthogRobotics-LED:LED
OC1 OC2 = optocoupler:PC817: SHARP OPTO COUPLER
Q1 = Auriga_lib:IRF9540
R1-R3 R6-R16 R18-R36 = WarthogRobotics-RLC:R
R4 R5 = rcl-2:R-EU_: RESISTOR, European symbol
R17 = rcl:R-US_: RESISTOR, American symbol; SPICEPREFIX: R
SH1 SH2 = BUCK_LM2576:PUSH_BUTTOM
U1 = WarthogRobotics-IC-Power:LM2576: Step-Down Voltage Regulator
U2 = WarthogRobotics-IC-Power:REG1117
U3 = WarthogRobotics-Transistors:2N7002,215; COPYRIGHT: Copyright (C) 2016 Accelerated Designs. All rights reserved; MANUFACTURER_PART_NUMBER: 2N7002,215; SOURCELIBRARY: Nexperia_2018-05-2018; VENDOR: Nexperia
U4 = WarthogRobotics-IC-Special_Function:CD4066B: CMOS QUAD BILATERAL SWITCH

## Net classes
0 Signal: width 0.457 mm, clearance 0.356 mm
1 Power: width 0.61 mm, clearance 0.406 mm